# Altium schematic sheet Power_Management_System.SchDoc: Power Management System (part 1 of 3)
size A3; CheckedBy: Jake Vidal, Noah Rondeau; Author: Alexander Cote; DrawnBy: Alexander Cote; Engineer: Alexander Cote; Organization: UVic AERO; DocumentNumber: 4; Revision: 1.1; SheetNumber: 4; SheetTotal: 5
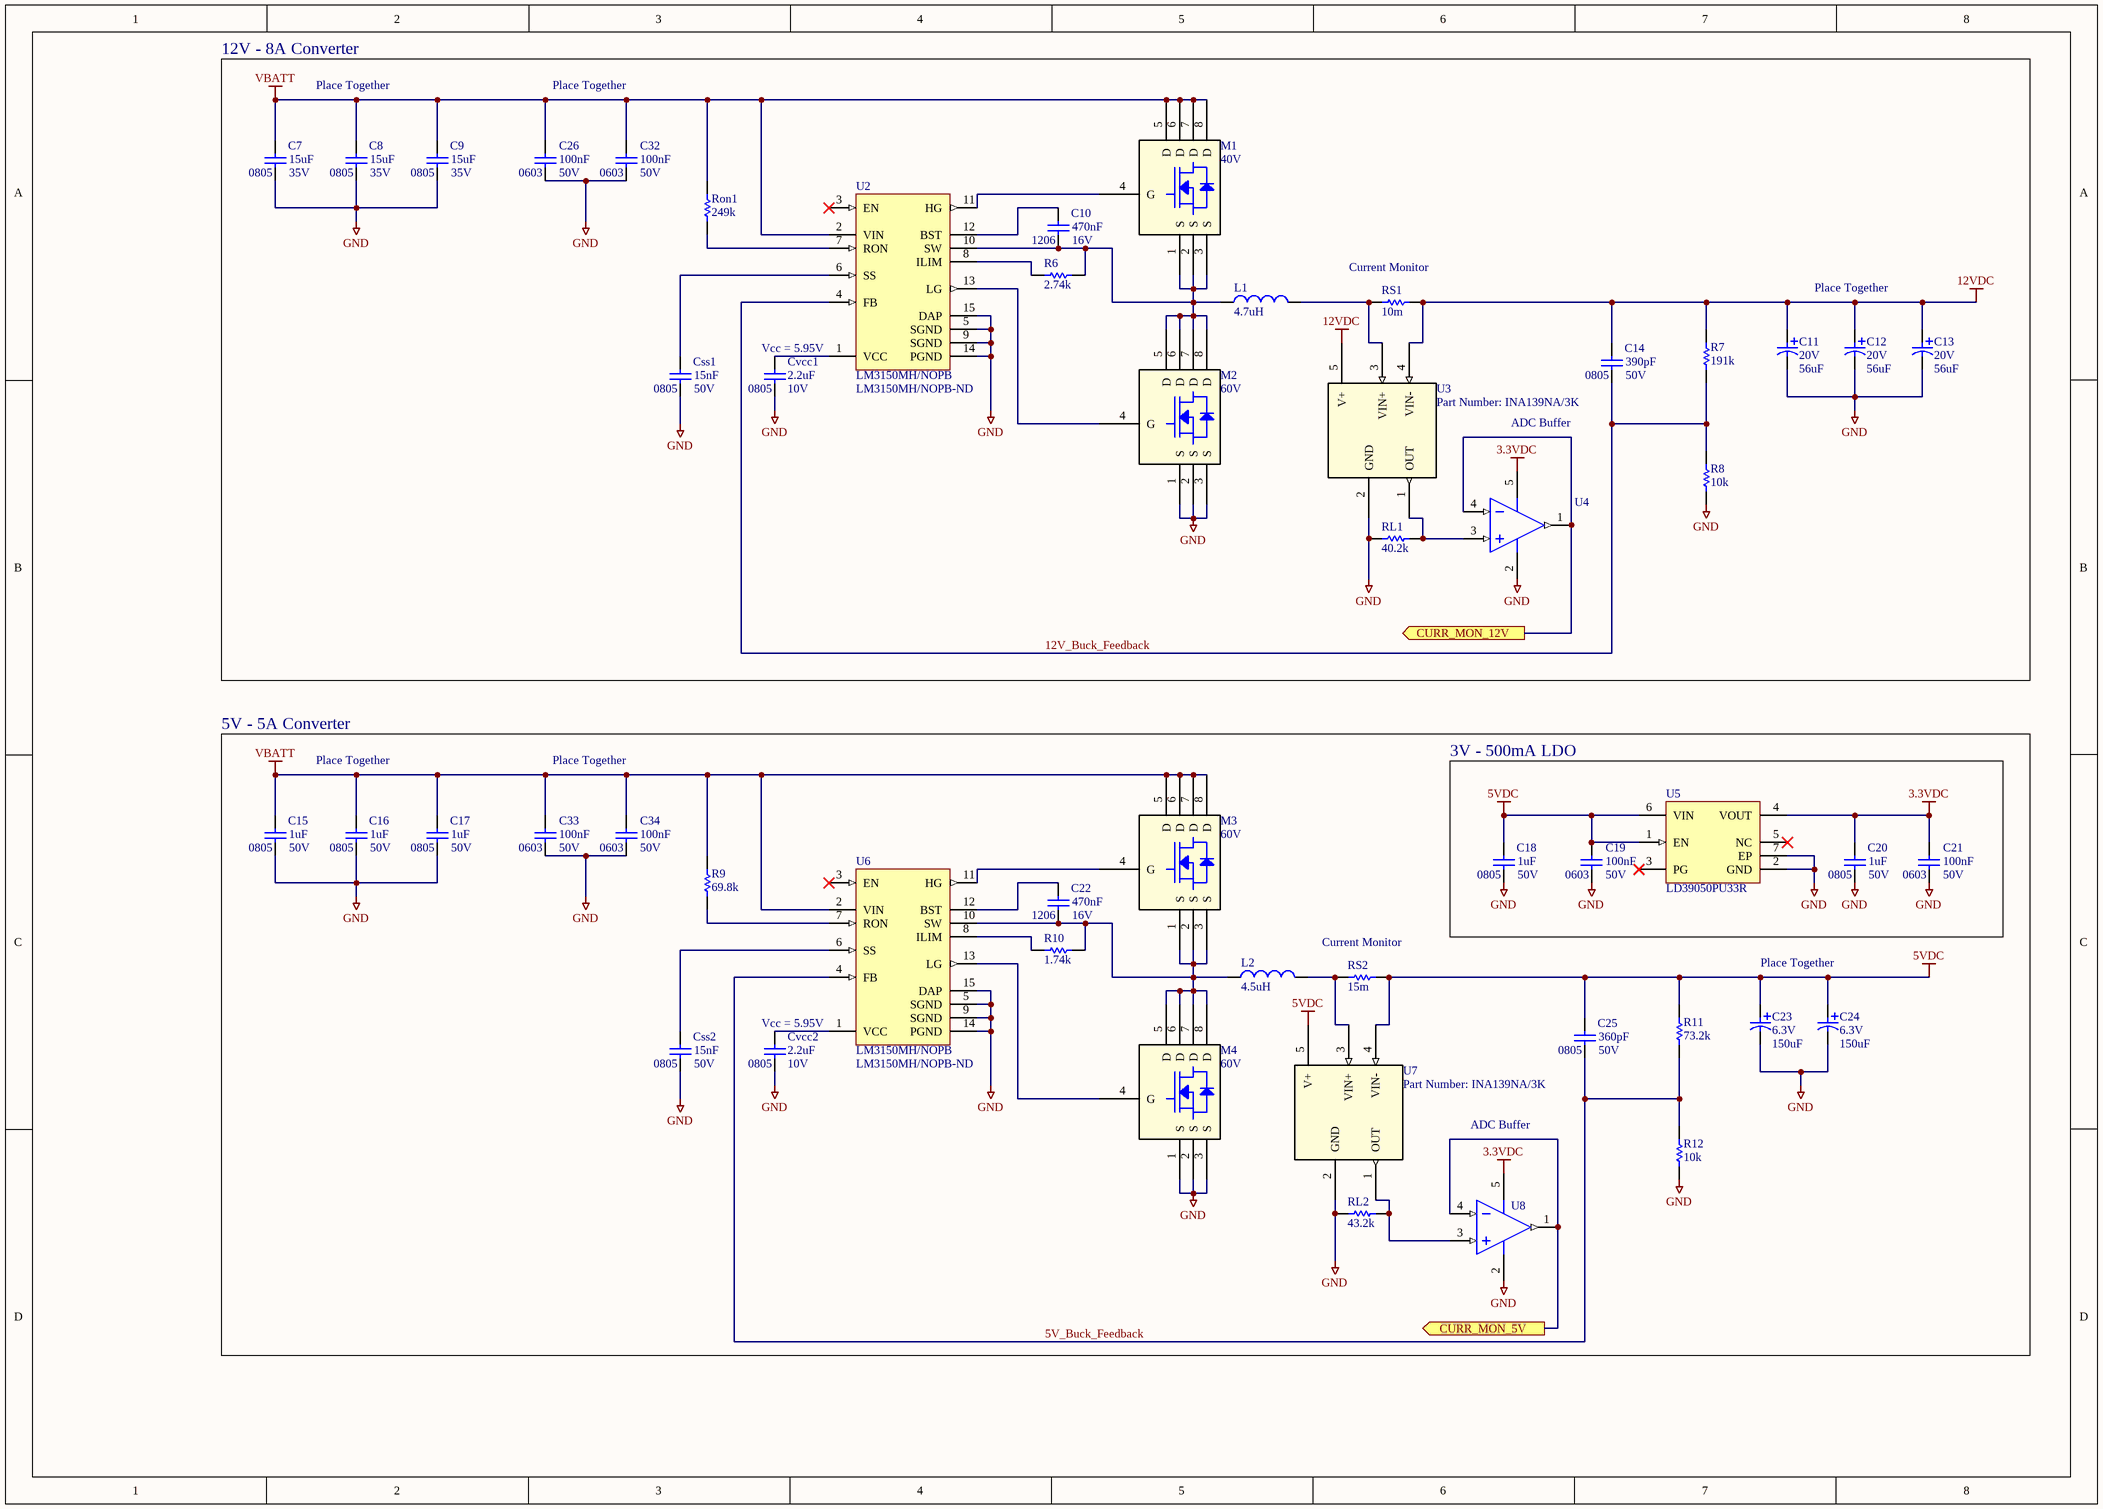
[diagram p0: Power_Management_System.SchDoc]

## Parts
C7  Voltage Rating: 35V  Case/Package: 0805  Capacitance: 15uF  [CAPC2012N(0805")]  (hidden comment: C2012X5R1V156M125AC)
C8  Voltage Rating: 35V  Case/Package: 0805  Capacitance: 15uF  [CAPC2012N(0805")]  (hidden comment: C2012X5R1V156M125AC)
C9  Voltage Rating: 35V  Case/Package: 0805  Capacitance: 15uF  [CAPC2012N(0805")]  (hidden comment: C2012X5R1V156M125AC)
C10  Voltage Rating: 16V  Case Code (Imperial): 1206  Capacitance: 470nF  [CAPC3216N(1206")]  (hidden comment: ECP-U1C474MA5)
C11  Voltage: 20V  Capacitance: 56uF  [PCAP_SVP_B6-M]  (hidden comment: 20SVPF56MX)
C12  Voltage: 20V  Capacitance: 56uF  [PCAP_SVP_B6-M]  (hidden comment: 20SVPF56MX)
C13  Voltage: 20V  Capacitance: 56uF  [PCAP_SVP_B6-M]  (hidden comment: 20SVPF56MX)
C14  Voltage: 50V  Case/Package: 0805  Capacitance: 390pF  [CAPC2012N(0805")]  (hidden comment: C0805C391J5GACTU)
C15  Voltage Rating: 50V  Case/Package: 0805  Capacitance: 1uF  [CAPC2012N(0805")]  (hidden comment: CL21A105KBCLNNC)
C16  Voltage Rating: 50V  Case/Package: 0805  Capacitance: 1uF  [CAPC2012N(0805")]  (hidden comment: CL21A105KBCLNNC)
C17  Voltage Rating: 50V  Case/Package: 0805  Capacitance: 1uF  [CAPC2012N(0805")]  (hidden comment: CL21A105KBCLNNC)
C18  Voltage Rating: 50V  Case/Package: 0805  Capacitance: 1uF  [CAPC2012N(0805")]  (hidden comment: CL21A105KBCLNNC)
C19  100nF  Case Code (Imperial): 0603  Voltage Rating: 50V  [CAPC1608N(0603")]
C20  Voltage Rating: 50V  Case/Package: 0805  Capacitance: 1uF  [CAPC2012N(0805")]  (hidden comment: CL21A105KBCLNNC)
C21  100nF  Case Code (Imperial): 0603  Voltage Rating: 50V  [CAPC1608N(0603")]
C22  Voltage Rating: 16V  Case Code (Imperial): 1206  Capacitance: 470nF  [CAPC3216N(1206")]  (hidden comment: ECP-U1C474MA5)
C23  Voltage: 6.3V  Capacitance: 150uF  [PCAP_SVP_B6-M]  (hidden comment: 6SVPE150M)
C24  Voltage: 6.3V  Capacitance: 150uF  [PCAP_SVP_B6-M]  (hidden comment: 6SVPE150M)
C25  Voltage Rating: 50V  Case/Package: 0805  Capacitance: 360pF  [CAPC2012N(0805")]  (hidden comment: CL21C361JBANNNC)
C26  100nF  Case Code (Imperial): 0603  Voltage Rating: 50V  [CAPC1608N(0603")]
C32  100nF  Case Code (Imperial): 0603  Voltage Rating: 50V  [CAPC1608N(0603")]
C33  100nF  Case Code (Imperial): 0603  Voltage Rating: 50V  [CAPC1608N(0603")]
C34  100nF  Case Code (Imperial): 0603  Voltage Rating: 50V  [CAPC1608N(0603")]
Css1  Voltage Rating: 50V  Case/Package: 0805  Capacitance: 15nF  [CAPC2012N(0805")]  (hidden comment: CGA4F2C0G1H153J085AA)
Css2  Voltage Rating: 50V  Case/Package: 0805  Capacitance: 15nF  [CAPC2012N(0805")]  (hidden comment: CGA4F2C0G1H153J085AA)
Cvcc1  Capacitance: 2.2uF  Voltage Rating: 10V  Case/Package: 0805  [CAPC2012N(0805")]  (hidden comment: LMK212B7225KG-T)
Cvcc2  Capacitance: 2.2uF  Voltage Rating: 10V  Case/Package: 0805  [CAPC2012N(0805")]  (hidden comment: LMK212B7225KG-T)
L1  Inductance: 4.7uH  [IND_BOURNS_SRP01_large]  (hidden comment: SRP1270-4R7M)
L2  Inductance: 4.5uH  [IND_BOURNS_SRR12]  (hidden comment: SRR1208-4R5ML)
M1  Drain to Source Voltage (Vdss): 40V  [DQJ8]  (hidden comment: CSD18504Q5A)
M2  Drain to Source Voltage (Vdss): 60V  [DQJ8]  (hidden comment: CSD18537NQ5A)
M3  Drain to Source Voltage (Vdss): 60V  [DQJ8]  (hidden comment: CSD18537NQ5A)
M4  Drain to Source Voltage (Vdss): 60V  [DQJ8]  (hidden comment: CSD18537NQ5A)
R6  Resistance: 2.74k  [RESC2012N(0805")]  (hidden comment: ERJ-6ENF2741V)
R7  Resistance: 191k  [RESC2012N(0805")]  (hidden comment: ERJ-6ENF1913V)
R8  Resistance: 10k  [RESC2012N(0805")]  (hidden comment: CRCW080510K0FKEA)
R9  Resistance: 69.8k  [RESC2012N(0805")]  (hidden comment: ERJ-6ENF6982V)
R10  Resistance: 1.74k  [RESC2012N(0805")]  (hidden comment: ERJ6ENF1741V)
R11  Resistance: 73.2k  [RESC2012N(0805")]  (hidden comment: ERJ-6ENF7322V)
R12  Resistance: 10k  [RESC2012N(0805")]  (hidden comment: CRCW080510K0FKEA)
RL1  Resistance: 40.2k  [RESC1608N(0603")]  (hidden comment: ERA3AEB4022V)
RL2  Resistance: 43.2k  [RESC1608N(0603")]  (hidden comment: ERA3AEB4322V)
Ron1  Resistance: 249k  [RESC2012N(0805")]  (hidden comment: CRCW0805249KFKEA)
RS1  Resistance: 10m  [RESC6332N(2512")]  (hidden comment: CRA2512-FZ-R010ELF)
RS2  Resistance: 15m  [RESC6332N(2512")]  (hidden comment: CRA2512-FZ-R015ELF)
U2  LM3150MH/NOPB  Supplier Part Number 1: LM3150MH/NOPB-ND  [PWP0014A_M]
U3  Part Number: INA139NA/3K  [DBV5-M]
U4  OPA340NA/3K  [DBV0005A_M]  (value not drawn)
U5  LD39050PU33R  [LDO3_3-DFN6D_M]
U6  LM3150MH/NOPB  Supplier Part Number 1: LM3150MH/NOPB-ND  [PWP0014A_M]
U7  Part Number: INA139NA/3K  [DBV5-M]
U8  OPA340NA/3K  [DBV0005A_M]  (value not drawn)

## Blocks framed on the sheet
12V - 8A Converter: C7-C14 C26 C32 Css1 Cvcc1 L1 M1 M2 R6-R8 RL1 Ron1 RS1 U2-U4
5V - 5A Converter: C15-C17 C22-C25 C33 C34 Css2 Cvcc2 L2 M3 M4 R9-R12 RL2 RS2 U6-U8
3V - 500mA LDO: C18-C21 U5

## Ports
CURR_MON_5V (out), CURR_MON_12V (out)

## Nets
3.3VDC: C20.2 C21.2 U4.5(V+) U5.4(VOUT) U8.5(V+)
5VDC: C18.2 C19.2 C23.1 C24.1 C25.2 R11.2 RS2.2 U5.1(EN) U5.6(VIN) U7.4(VIN-) U7.5(V+)
12VDC: C11.1 C12.1 C13.1 C14.2 R7.2 RS1.2 U3.4(VIN-) U3.5(V+)
GND: C7.1 C8.1 C9.1 C11.2 C12.2 C13.2 C15.1 C16.1 C17.1 C18.1 C19.1 C20.1 C21.1 C23.2 C24.2 C26.1 C32.1 C33.1 C34.1 Css1.1 Css2.1 Cvcc1.1 Cvcc2.1 M2.1(S) M2.2(S) M2.3(S) M4.1(S) M4.2(S) M4.3(S) R8.1 R12.1 RL1.1 RL2.1 U2.5(SGND) U2.9(SGND) U2.14(PGND) U2.15(DAP) U3.2(GND) U4.2(V-) U5.2(GND) U5.7(EP) U6.5(SGND) U6.9(SGND) U6.14(PGND) U6.15(DAP) U7.2(GND) U8.2(V-)
VBATT: C7.2 C8.2 C9.2 C15.2 C16.2 C17.2 C26.2 C32.2 C33.2 C34.2 M1.5(D) M1.6(D) M1.7(D) M1.8(D) M3.5(D) M3.6(D) M3.7(D) M3.8(D) R9.2 Ron1.2 U2.2(VIN) U6.2(VIN)
5V_Buck_Feedback: C25.1 R11.1 R12.2 U6.4(FB)
12V_Buck_Feedback: C14.1 R7.1 R8.2 U2.4(FB)
CURR_MON_5V: U8.1(OUT) U8.4(IN-) ; port CURR_MON_5V
CURR_MON_12V: U4.1(OUT) U4.4(IN-) ; port CURR_MON_12V
NetC10_1: C10.1 L1.1 M1.1(S) M1.2(S) M1.3(S) M2.5(D) M2.6(D) M2.7(D) M2.8(D) R6.2 U2.10(SW)
NetC10_2: C10.2 U2.12(BST)
NetC22_1: C22.1 L2.1 M3.1(S) M3.2(S) M3.3(S) M4.5(D) M4.6(D) M4.7(D) M4.8(D) R10.2 U6.10(SW)
NetC22_2: C22.2 U6.12(BST)
NetCss1_2: Css1.2 U2.6(SS)
NetCss2_2: Css2.2 U6.6(SS)
NetCvcc1_2: Cvcc1.2 U2.1(VCC)
NetCvcc2_2: Cvcc2.2 U6.1(VCC)
NetL1_2: L1.2 RS1.1 U3.3(VIN+)
NetL2_2: L2.2 RS2.1 U7.3(VIN+)
NetM1_4: M1.4(G) U2.11(HG)
NetM2_4: M2.4(G) U2.13(LG)
NetM3_4: M3.4(G) U6.11(HG)
NetM4_4: M4.4(G) U6.13(LG)
NetR6_1: R6.1 U2.8(ILIM)
NetR9_1: R9.1 U6.7(RON)
NetR10_1: R10.1 U6.8(ILIM)
NetRL1_2: RL1.2 U3.1(OUT) U4.3(IN+)
NetRL2_2: RL2.2 U7.1(OUT) U8.3(IN+)
NetRon1_1: Ron1.1 U2.7(RON)

Not connected (* = marked no-connect by the designer): U2 3(EN)*; U5 3(PG)* 5(NC)*; U6 3(EN)*

## Notes on the sheet
- Place Together
- (near RS1) Current Monitor
- (near Cvcc1) Vcc = 5.95V
- ADC Buffer
- Current Monitor
- (near Cvcc2) Vcc = 5.95V